# Altium schematic sheet ESenseFE-FilterBank1.SchDoc (part 1 of 2)
size D
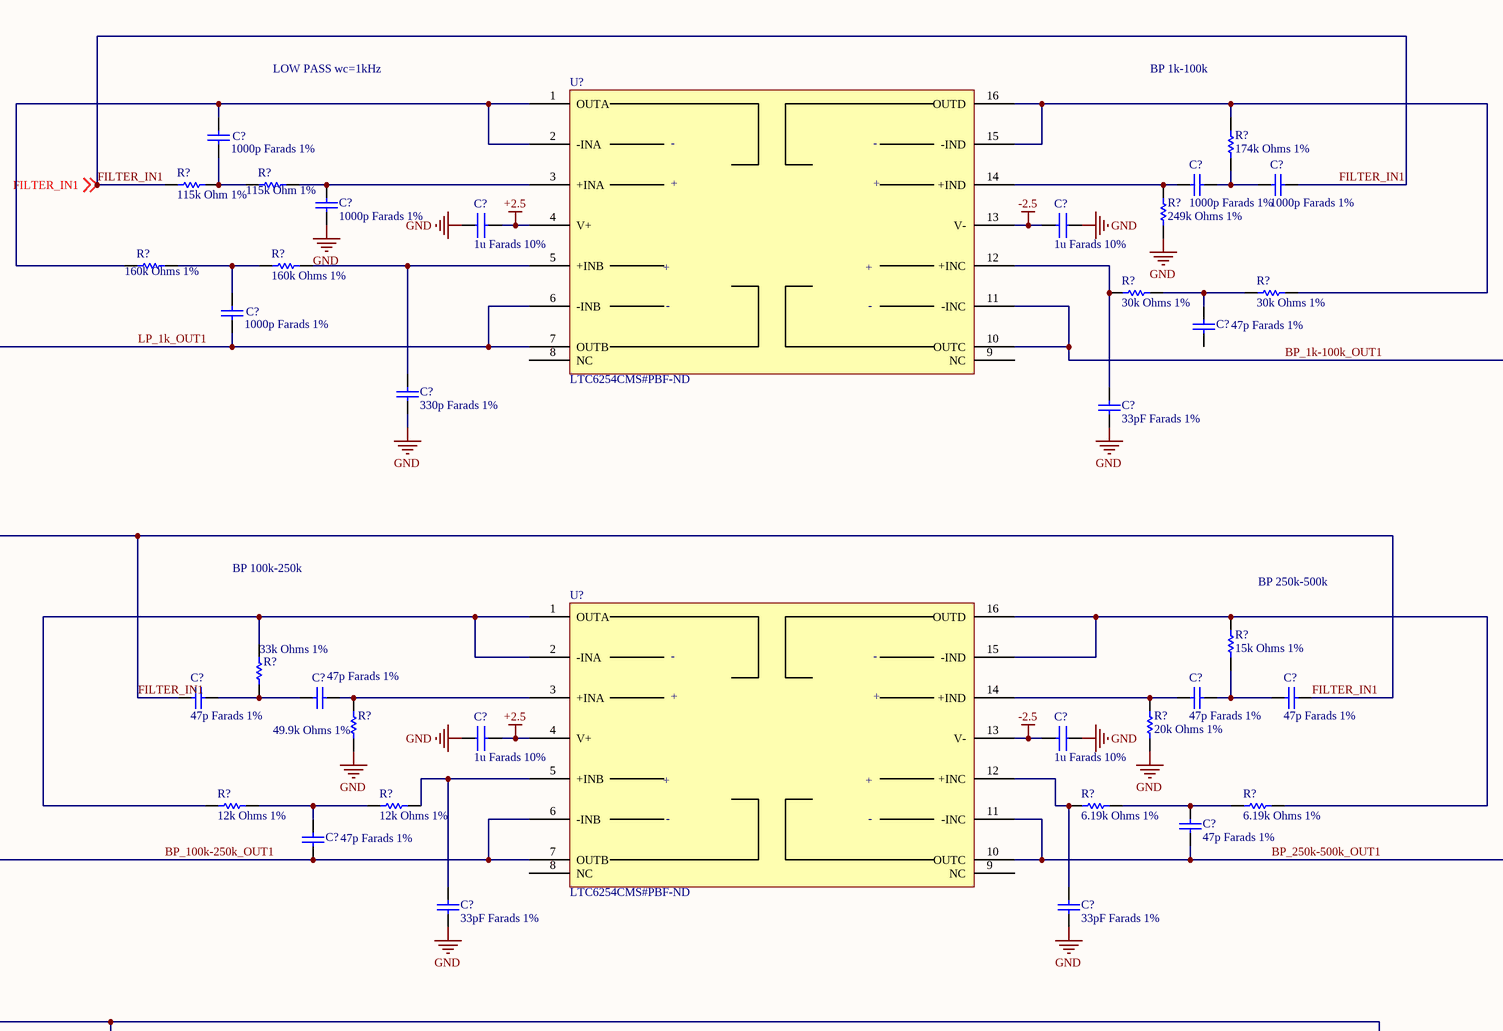
[diagram p0: ESenseFE-FilterBank1.SchDoc, top left]
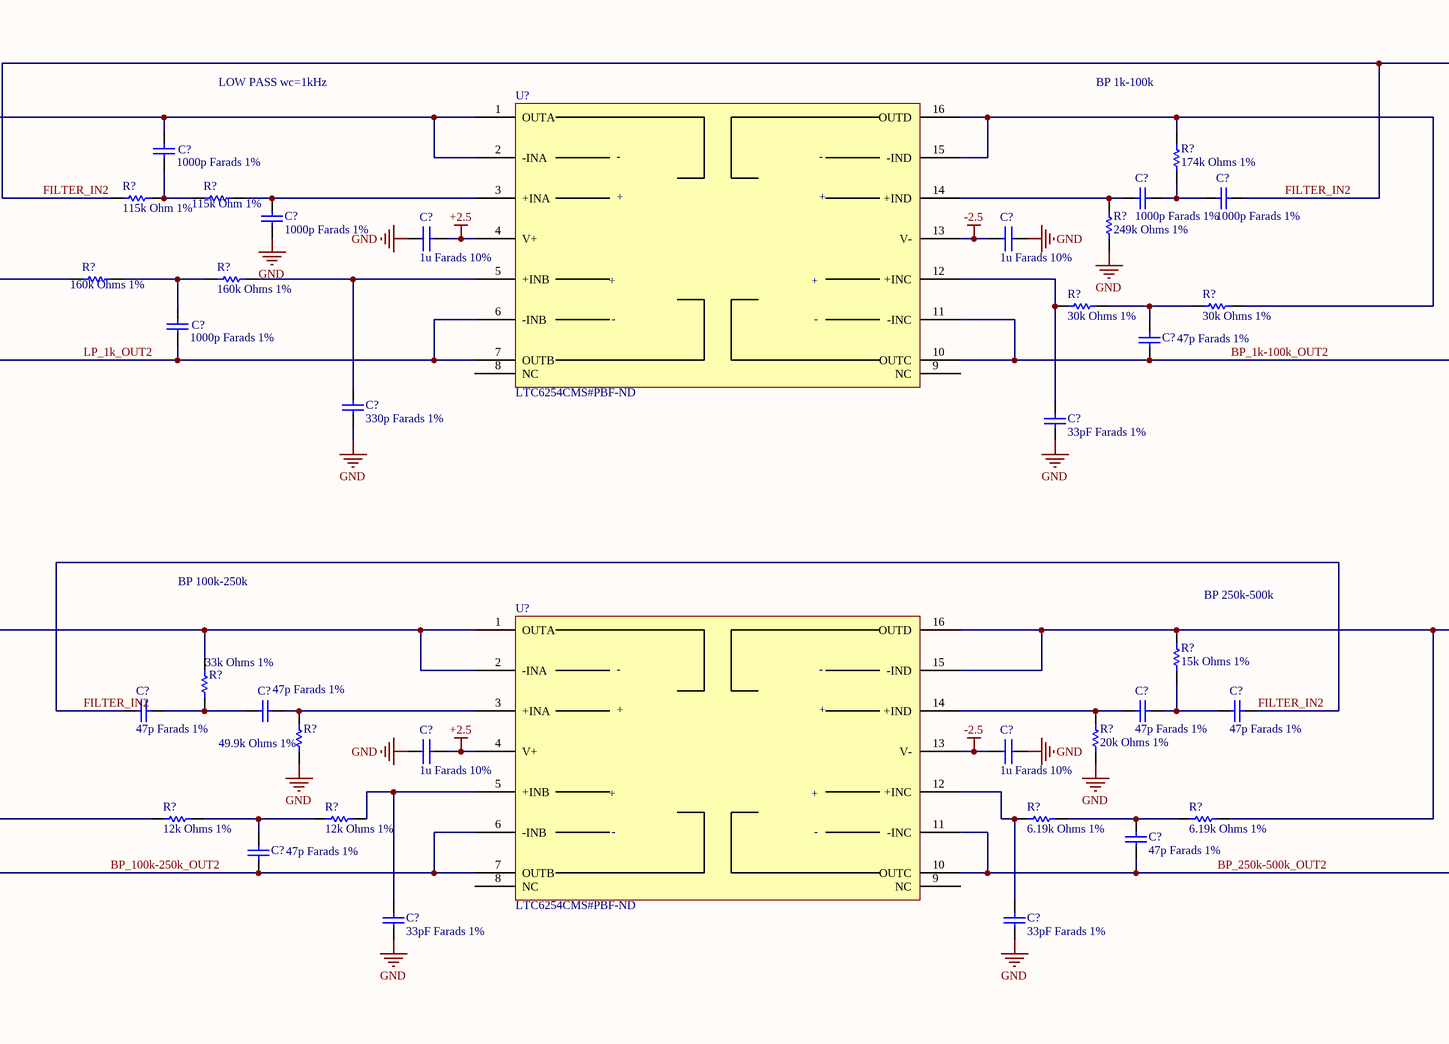
[diagram p1: ESenseFE-FilterBank1.SchDoc, top right]
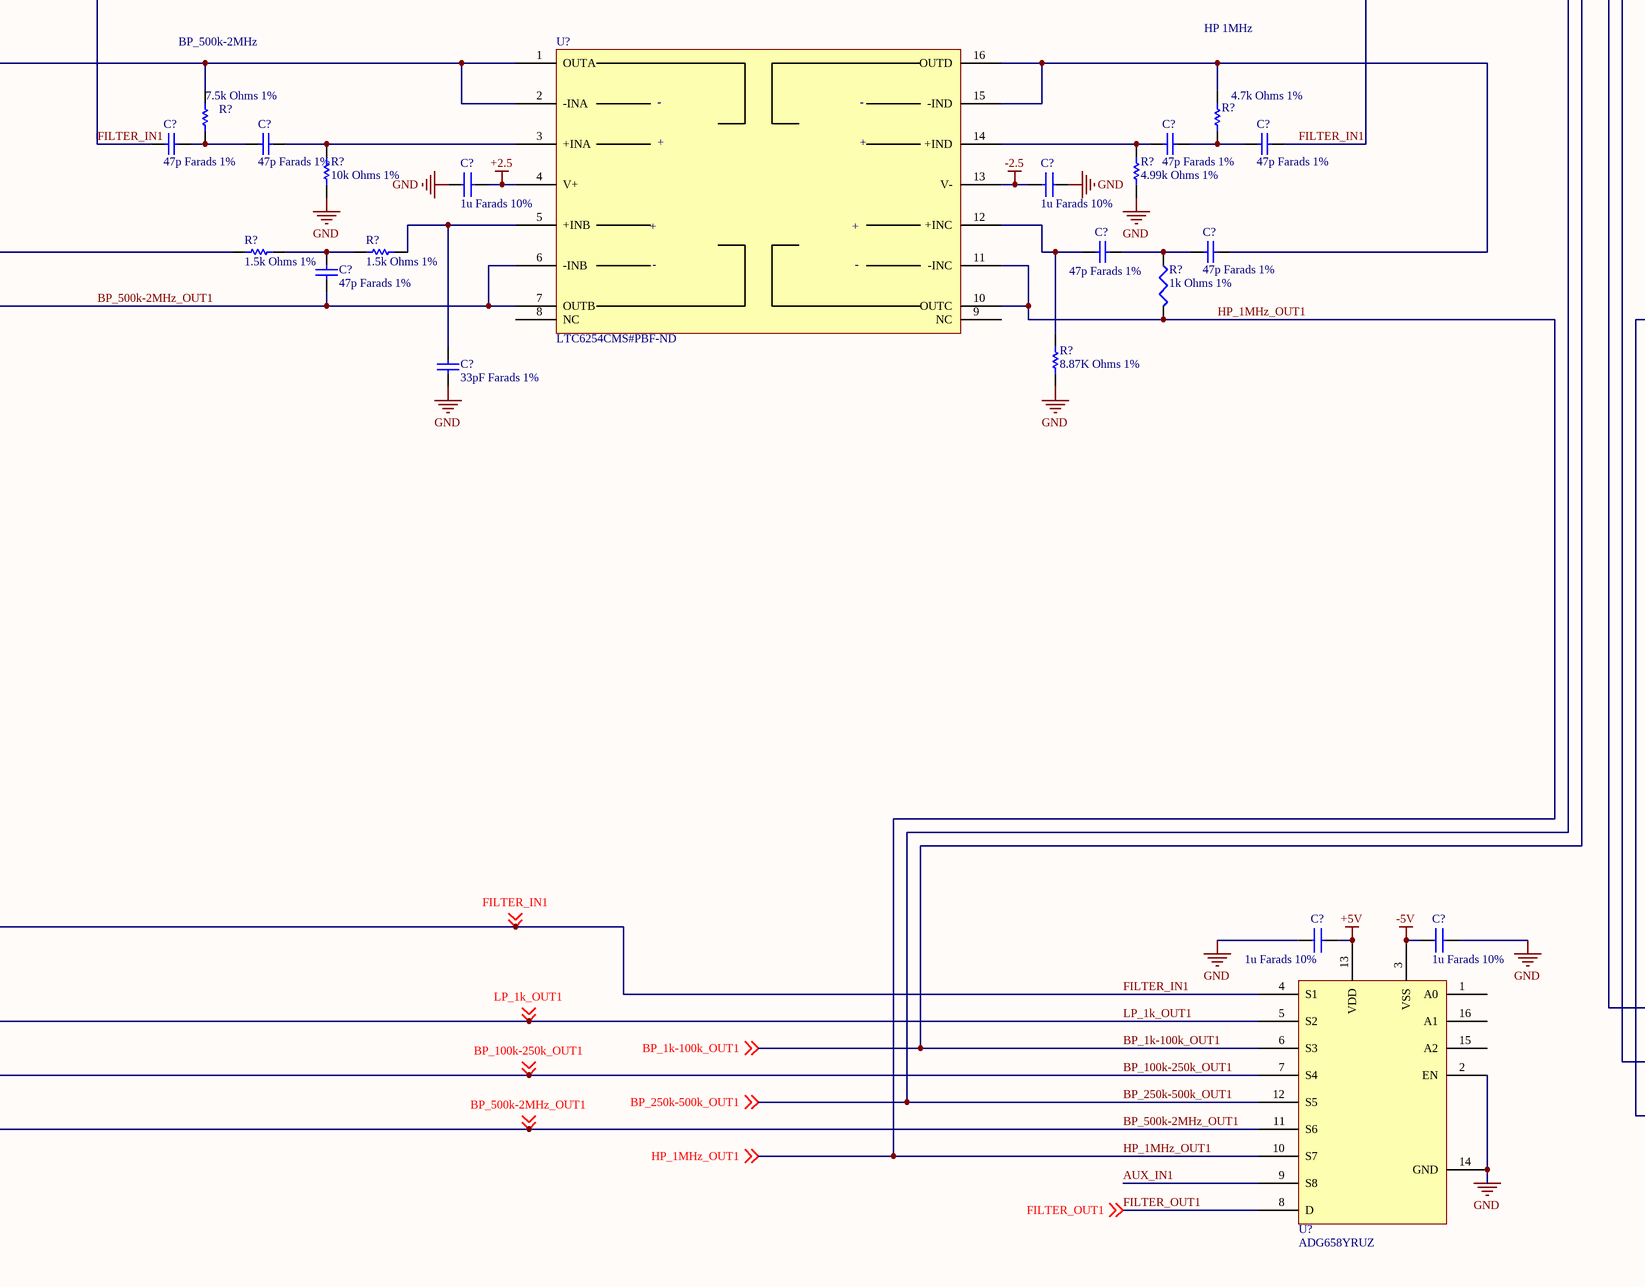
[diagram p2: ESenseFE-FilterBank1.SchDoc, bottom left]
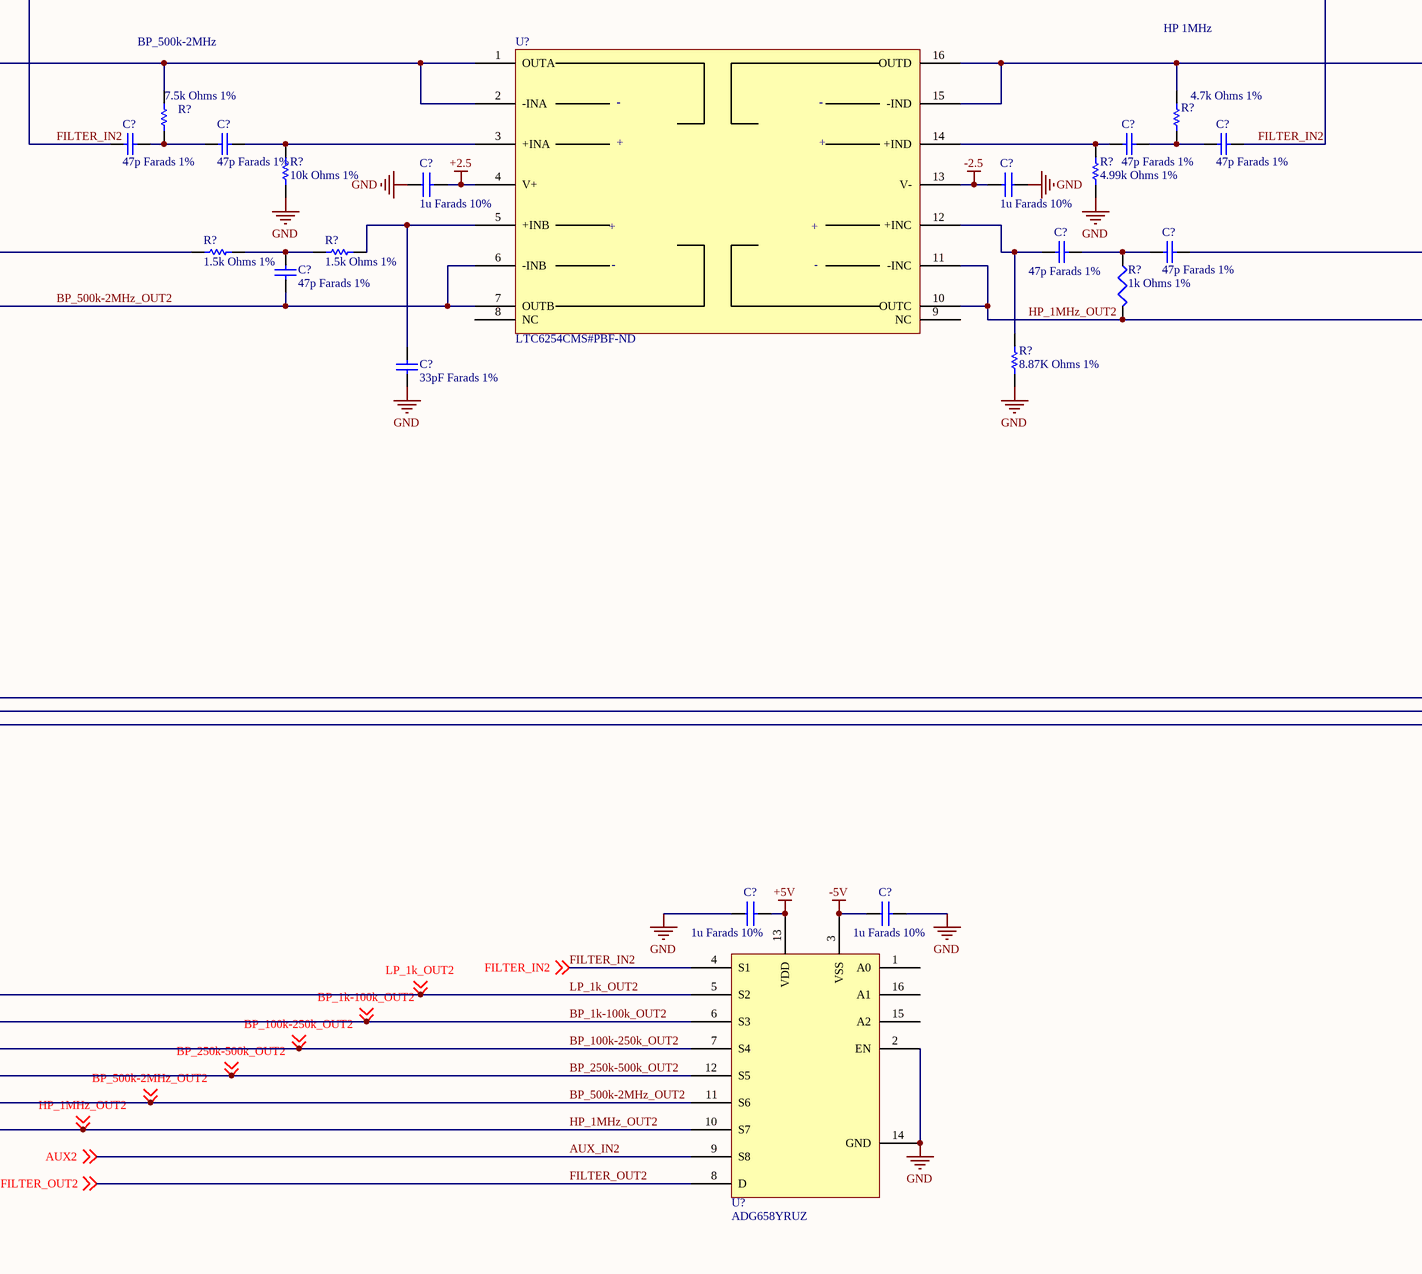
[diagram p3: ESenseFE-FilterBank1.SchDoc, bottom right]

## Parts
(Parts that share a designator on the sheet are numbered #1, #2 ... from top to bottom, then left to right.)
C?#1  1000p Farads 1%  [SM/C_0603]
C?#2  1000p Farads 1%  [SM/C_0603]
C?#3  1000p Farads 1%  [SM/C_0603]
C?#4  1000p Farads 1%  [SM/C_0603]
C?#5  1000p Farads 1%  [SM/C_0603]
C?#6  1000p Farads 1%  [SM/C_0603]
C?#7  1000p Farads 1%  [SM/C_0603]
C?#8  1u Farads 10%  [SM/C_0603]
C?#9  1u Farads 10%  [SM/C_0603]
C?#10  1000p Farads 1%  [SM/C_0603]
C?#11  1u Farads 10%  [SM/C_0603]
C?#12  1u Farads 10%  [SM/C_0603]
C?#13  1000p Farads 1%  [SM/C_0603]
C?#14  47p Farads 1%  [SM/C_0603]
C?#15  1000p Farads 1%  [SM/C_0603]
C?#16  47p Farads 1%  [SM/C_0603]
C?#17  330p Farads 1%  [SM/C_0603]
C?#18  33pF Farads 1%  [SM/C_0603]
C?#19  330p Farads 1%  [SM/C_0603]
C?#20  33pF Farads 1%  [SM/C_0603]
C?#21  47p Farads 1%  [SM/C_0603]
C?#22  47p Farads 1%  [SM/C_0603]
C?#23  47p Farads 1%  [SM/C_0603]
C?#24  47p Farads 1%  [SM/C_0603]
C?#25  47p Farads 1%  [SM/C_0603]
C?#26  47p Farads 1%  [SM/C_0603]
C?#27  47p Farads 1%  [SM/C_0603]
C?#28  47p Farads 1%  [SM/C_0603]
C?#29  1u Farads 10%  [SM/C_0603]
C?#30  1u Farads 10%  [SM/C_0603]
C?#31  1u Farads 10%  [SM/C_0603]
C?#32  1u Farads 10%  [SM/C_0603]
C?#33  47p Farads 1%  [SM/C_0603]
C?#34  47p Farads 1%  [SM/C_0603]
C?#35  47p Farads 1%  [SM/C_0603]
C?#36  47p Farads 1%  [SM/C_0603]
C?#37  33pF Farads 1%  [SM/C_0603]
C?#38  33pF Farads 1%  [SM/C_0603]
C?#39  33pF Farads 1%  [SM/C_0603]
C?#40  33pF Farads 1%  [SM/C_0603]
C?#41  47p Farads 1%  [SM/C_0603]
C?#42  47p Farads 1%  [SM/C_0603]
C?#43  47p Farads 1%  [SM/C_0603]
C?#44  47p Farads 1%  [SM/C_0603]
C?#45  47p Farads 1%  [SM/C_0603]
C?#46  47p Farads 1%  [SM/C_0603]
C?#47  47p Farads 1%  [SM/C_0603]
C?#48  47p Farads 1%  [SM/C_0603]
C?#49  1u Farads 10%  [SM/C_0603]
C?#50  1u Farads 10%  [SM/C_0603]
C?#51  1u Farads 10%  [SM/C_0603]
C?#52  1u Farads 10%  [SM/C_0603]
C?#53  47p Farads 1%  [SM/C_0603]
C?#54  47p Farads 1%  [SM/C_0603]
C?#55  47p Farads 1%  [SM/C_0603]
C?#56  47p Farads 1%  [SM/C_0603]
C?#57  47p Farads 1%  [SM/C_0603]
C?#58  47p Farads 1%  [SM/C_0603]
C?#59  33pF Farads 1%  [SM/C_0603]
C?#60  33pF Farads 1%  [SM/C_0603]
C?#61  1u Farads 10%  [SM/C_0603]
C?#62  1u Farads 10%  [SM/C_0603]
C?#63  1u Farads 10%  [SM/C_0603]
C?#64  1u Farads 10%  [SM/C_0603]
R?#1  174k Ohms 1%  [SM/R_0603]
R?#2  115k Ohm 1%  [SM/R_0603]
R?#3  115k Ohm 1%  [SM/R_0603]
R?#4  174k Ohms 1%  [SM/R_0603]
R?#5  115k Ohm 1%  [SM/R_0603]
R?#6  115k Ohm 1%  [SM/R_0603]
R?#7  249k Ohms 1%  [SM/C_0603]
R?#8  249k Ohms 1%  [SM/C_0603]
R?#9  160k Ohms 1%  [SM/R_0603]
R?#10  160k Ohms 1%  [SM/R_0603]
R?#11  160k Ohms 1%  [SM/R_0603]
R?#12  160k Ohms 1%  [SM/R_0603]
R?#13  30k Ohms 1%  [SM/R_0603]
R?#14  30k Ohms 1%  [SM/R_0603]
R?#15  30k Ohms 1%  [SM/R_0603]
R?#16  30k Ohms 1%  [SM/R_0603]
R?#17  15k Ohms 1%  [SM/R_0603]
R?#18  15k Ohms 1%  [SM/R_0603]
R?#19  33k Ohms 1%  [SM/R_0603]
R?#20  33k Ohms 1%  [SM/R_0603]
R?#21  49.9k Ohms 1%  [SM/R_0603]
R?#22  20k Ohms 1%  [SM/R_0603]
R?#23  49.9k Ohms 1%  [SM/R_0603]
R?#24  20k Ohms 1%  [SM/R_0603]
R?#25  12k Ohms 1%  [SM/R_0603]
R?#26  12k Ohms 1%  [SM/R_0603]
R?#27  6.19k Ohms 1%  [SM/R_0603]
R?#28  6.19k Ohms 1%  [SM/R_0603]
R?#29  12k Ohms 1%  [SM/R_0603]
R?#30  12k Ohms 1%  [SM/R_0603]
R?#31  6.19k Ohms 1%  [SM/R_0603]
R?#32  6.19k Ohms 1%  [SM/R_0603]
R?#33  7.5k Ohms 1%  [SM/R_0603]
R?#34  4.7k Ohms 1%  [SM/R_0603]
R?#35  7.5k Ohms 1%  [SM/R_0603]
R?#36  4.7k Ohms 1%  [SM/R_0603]
R?#37  10k Ohms 1%  [SM/R_0603]
R?#38  4.99k Ohms 1%  [SM/R_0603]
R?#39  10k Ohms 1%  [SM/R_0603]
R?#40  4.99k Ohms 1%  [SM/R_0603]
R?#41  1.5k Ohms 1%  [SM/R_0603]
R?#42  1.5k Ohms 1%  [SM/R_0603]
R?#43  1.5k Ohms 1%  [SM/R_0603]
R?#44  1.5k Ohms 1%  [SM/R_0603]
R?#45  1k Ohms 1%  [SM/C_0603]
R?#46  1k Ohms 1%  [SM/C_0603]
R?#47  8.87K Ohms 1%  [SM/C_0603]
R?#48  8.87K Ohms 1%  [SM/C_0603]
U?#1  LTC6254CMS#PBF-ND  [MSOP-16Lead-LTC6254]
U?#2  LTC6254CMS#PBF-ND  [MSOP-16Lead-LTC6254]
U?#3  LTC6254CMS#PBF-ND  [MSOP-16Lead-LTC6254]
U?#4  LTC6254CMS#PBF-ND  [MSOP-16Lead-LTC6254]
U?#5  LTC6254CMS#PBF-ND  [MSOP-16Lead-LTC6254]
U?#6  LTC6254CMS#PBF-ND  [MSOP-16Lead-LTC6254]
U?#7  ADG658YRUZ  [TSSOP-16-pin-analog-devices-RU-16]
U?#8  ADG658YRUZ  [TSSOP-16-pin-analog-devices-RU-16]

## Nets
+2.5: C?#8.2 C?#11.2 C?#29.2 C?#31.2 C?#49.2 C?#51.2 U?#1.4(V+) U?#2.4(V+) U?#3.4(V+) U?#4.4(V+) U?#5.4(V+) U?#6.4(V+)
+5V: C?#61.2 C?#63.2 U?#7.13(VDD) U?#8.13(VDD)
-2.5: C?#9.2 C?#12.2 C?#30.2 C?#32.2 C?#50.2 C?#52.2 U?#1.13(V-) U?#2.13(V-) U?#3.13(V-) U?#4.13(V-) U?#5.13(V-) U?#6.13(V-)
-5V: C?#62.1 C?#64.1 U?#7.3(VSS) U?#8.3(VSS)
GND: C?#7.1 C?#8.1 C?#9.1 C?#10.1 C?#11.1 C?#12.1 C?#17.1 C?#18.1 C?#19.1 C?#20.1 C?#29.1 C?#30.1 C?#31.1 C?#32.1 C?#37.1 C?#38.1 C?#39.1 C?#40.1 C?#49.1 C?#50.1 C?#51.1 C?#52.1 C?#59.1 C?#60.1 C?#61.1 C?#62.2 C?#63.1 C?#64.2 R?#7.1 R?#8.1 R?#21.1 R?#22.1 R?#23.1 R?#24.1 R?#37.1 R?#38.1 R?#39.1 R?#40.1 R?#47.1 R?#48.1 U?#7.2(EN) U?#7.14(GND) U?#8.2(EN) U?#8.14(GND)
AUX_IN1: U?#8.9(S8)
AUX_IN2: U?#7.9(S8) ; off-sheet AUX2  [also labelled AUX2]
BP_1k-100k_OUT1: U?#1.10(OUTC) U?#1.11(-INC) U?#8.6(S3) ; off-sheet BP_1k-100k_OUT1
BP_1k-100k_OUT2: C?#16.1 U?#2.10(OUTC) U?#2.11(-INC) U?#7.6(S3) ; off-sheet BP_1k-100k_OUT2
BP_100k-250k_OUT1: C?#34.1 U?#3.6(-INB) U?#3.7(OUTB) U?#8.7(S4) ; off-sheet BP_100k-250k_OUT1
BP_100k-250k_OUT2: C?#36.1 U?#4.6(-INB) U?#4.7(OUTB) U?#7.7(S4) ; off-sheet BP_100k-250k_OUT2
BP_250k-500k_OUT1: C?#33.1 U?#3.10(OUTC) U?#3.11(-INC) U?#8.12(S5) ; off-sheet BP_250k-500k_OUT1
BP_250k-500k_OUT2: C?#35.1 U?#4.10(OUTC) U?#4.11(-INC) U?#7.12(S5) ; off-sheet BP_250k-500k_OUT2
BP_500k-2MHz_OUT1: C?#57.1 U?#5.6(-INB) U?#5.7(OUTB) U?#8.11(S6) ; off-sheet BP_500k-2MHz_OUT1
BP_500k-2MHz_OUT2: C?#58.1 U?#6.6(-INB) U?#6.7(OUTB) U?#7.11(S6) ; off-sheet BP_500k-2MHz_OUT2
FILTER_IN1: C?#4.1 C?#21.2 C?#24.1 C?#41.2 C?#44.1 R?#2.1 U?#8.4(S1) ; off-sheet FILTER_IN1
FILTER_IN2: C?#6.1 C?#25.2 C?#28.1 C?#45.2 C?#48.1 C?#56.1 R?#5.1 R?#18.2 R?#32.2 R?#36.2 U?#4.15(-IND) U?#4.16(OUTD) U?#6.15(-IND) U?#6.16(OUTD) U?#7.4(S1) ; off-sheet FILTER_IN2
FILTER_OUT1: U?#8.8(D) ; off-sheet FILTER_OUT1
FILTER_OUT2: U?#7.8(D) ; off-sheet FILTER_OUT2
HP_1MHz_OUT1: R?#45.2 U?#5.10(OUTC) U?#5.11(-INC) U?#8.10(S7) ; off-sheet HP_1MHz_OUT1
HP_1MHz_OUT2: R?#46.2 U?#6.10(OUTC) U?#6.11(-INC) U?#7.10(S7) ; off-sheet HP_1MHz_OUT2
LP_1k_OUT1: C?#13.1 U?#1.6(-INB) U?#1.7(OUTB) U?#8.5(S2) ; off-sheet LP_1k_OUT1
LP_1k_OUT2: C?#15.1 U?#2.6(-INB) U?#2.7(OUTB) U?#7.5(S2) ; off-sheet LP_1k_OUT2
NetC?#1_1: C?#1.1 R?#2.2 R?#3.1
NetC?#1_2: C?#1.2 R?#9.1 U?#1.1(OUTA) U?#1.2(-INA)
NetC?#2_1: C?#2.1 R?#5.2 R?#6.1
NetC?#2_2: C?#2.2 R?#11.1 U?#2.1(OUTA) U?#2.2(-INA)
NetC?#3_1: C?#3.1 C?#4.2 R?#1.1
NetC?#3_2: C?#3.2 R?#7.2 U?#1.14(+IND)
NetC?#5_1: C?#5.1 C?#6.2 R?#4.1
NetC?#5_2: C?#5.2 R?#8.2 U?#2.14(+IND)
NetC?#7_2: C?#7.2 R?#3.2 U?#1.3(+INA)
NetC?#10_2: C?#10.2 R?#6.2 U?#2.3(+INA)
NetC?#13_2: C?#13.2 R?#9.2 R?#10.1
NetC?#14_2: C?#14.2 R?#13.2 R?#14.1
NetC?#15_2: C?#15.2 R?#11.2 R?#12.1
NetC?#16_2: C?#16.2 R?#15.2 R?#16.1
NetC?#17_2: C?#17.2 R?#10.2 U?#1.5(+INB)
NetC?#18_2: C?#18.2 R?#13.1 U?#1.12(+INC)
NetC?#19_2: C?#19.2 R?#12.2 U?#2.5(+INB)
NetC?#20_2: C?#20.2 R?#15.1 U?#2.12(+INC)
NetC?#21_1: C?#21.1 C?#22.2 R?#19.1
NetC?#22_1: C?#22.1 R?#21.2 U?#3.3(+INA)
NetC?#23_1: C?#23.1 C?#24.2 R?#17.1
NetC?#23_2: C?#23.2 R?#22.2 U?#3.14(+IND)
NetC?#25_1: C?#25.1 C?#26.2 R?#20.1
NetC?#26_1: C?#26.1 R?#23.2 U?#4.3(+INA)
NetC?#27_1: C?#27.1 C?#28.2 R?#18.1
NetC?#27_2: C?#27.2 R?#24.2 U?#4.14(+IND)
NetC?#33_2: C?#33.2 R?#27.2 R?#28.1
NetC?#34_2: C?#34.2 R?#25.2 R?#26.1
NetC?#35_2: C?#35.2 R?#31.2 R?#32.1
NetC?#36_2: C?#36.2 R?#29.2 R?#30.1
NetC?#37_2: C?#37.2 R?#26.2 U?#3.5(+INB)
NetC?#38_2: C?#38.2 R?#27.1 U?#3.12(+INC)
NetC?#39_2: C?#39.2 R?#30.2 U?#4.5(+INB)
NetC?#40_2: C?#40.2 R?#31.1 U?#4.12(+INC)
NetC?#41_1: C?#41.1 C?#42.2 R?#33.1
NetC?#42_1: C?#42.1 R?#37.2 U?#5.3(+INA)
NetC?#43_1: C?#43.1 C?#44.2 R?#34.1
NetC?#43_2: C?#43.2 R?#38.2 U?#5.14(+IND)
NetC?#45_1: C?#45.1 C?#46.2 R?#35.1
NetC?#46_1: C?#46.1 R?#39.2 U?#6.3(+INA)
NetC?#47_1: C?#47.1 C?#48.2 R?#36.1
NetC?#47_2: C?#47.2 R?#40.2 U?#6.14(+IND)
NetC?#53_1: C?#53.1 C?#54.2 R?#45.1
NetC?#53_2: C?#53.2 R?#47.2 U?#5.12(+INC)
NetC?#54_1: C?#54.1 R?#34.2 U?#5.15(-IND) U?#5.16(OUTD)
NetC?#55_1: C?#55.1 C?#56.2 R?#46.1
NetC?#55_2: C?#55.2 R?#48.2 U?#6.12(+INC)
NetC?#57_2: C?#57.2 R?#41.2 R?#42.1
NetC?#58_2: C?#58.2 R?#43.2 R?#44.1
NetC?#59_2: C?#59.2 R?#42.2 U?#5.5(+INB)
NetC?#60_2: C?#60.2 R?#44.2 U?#6.5(+INB)
NetR?#1_2: R?#1.2 R?#14.2 U?#1.15(-IND) U?#1.16(OUTD)
NetR?#4_2: R?#4.2 R?#16.2 U?#2.15(-IND) U?#2.16(OUTD)
NetR?#17_2: R?#17.2 R?#28.2 U?#3.15(-IND) U?#3.16(OUTD)
NetR?#19_2: R?#19.2 R?#25.1 U?#3.1(OUTA) U?#3.2(-INA)
NetR?#20_2: R?#20.2 R?#29.1 U?#4.1(OUTA) U?#4.2(-INA)
NetR?#33_2: R?#33.2 R?#41.1 U?#5.1(OUTA) U?#5.2(-INA)
NetR?#35_2: R?#35.2 R?#43.1 U?#6.1(OUTA) U?#6.2(-INA)

Not connected (* = marked no-connect by the designer): C?#14 1; U?#1 8(NC) 9(NC); U?#2 8(NC) 9(NC); U?#3 8(NC) 9(NC); U?#4 8(NC) 9(NC); U?#5 8(NC) 9(NC); U?#6 8(NC) 9(NC); U?#7 1(A0) 15(A2) 16(A1); U?#8 1(A0) 15(A2) 16(A1)

## Notes on the sheet
- LOW PASS wc=1kHz
- BP 1k-100k
- BP 100k-250k
- (near R?#17) BP 250k-500k
- (near R?#18) BP 250k-500k
- HP 1MHz
- BP_500k-2MHz
- (in symbol 2191) -; +